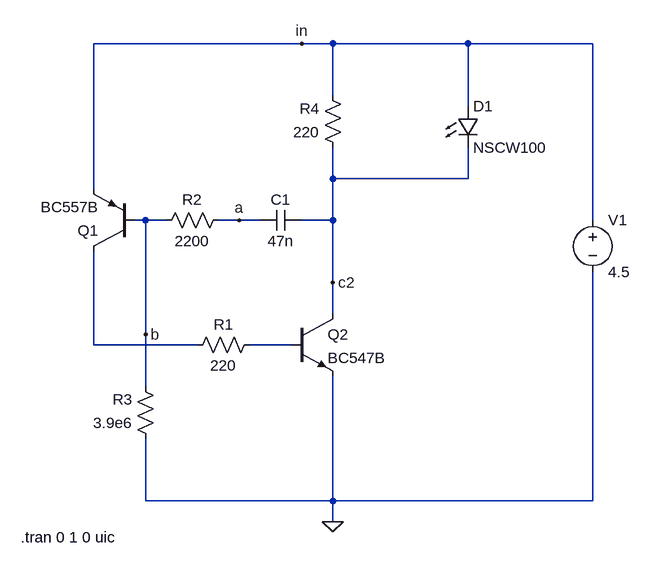
[diagram p0: schematic Draft1.asc]
Draft1.asc, the LTspice schematic file:
Version 4
SHEET 1 912 696
WIRE 400 -80 80 -80
WIRE 448 -80 400 -80
WIRE 656 -80 448 -80
WIRE 848 -80 656 -80
WIRE 448 0 448 -80
WIRE 656 16 656 -80
WIRE 448 128 448 80
WIRE 656 128 656 80
WIRE 656 128 448 128
WIRE 80 144 80 -80
WIRE 160 192 144 192
WIRE 192 192 160 192
WIRE 304 192 272 192
WIRE 336 192 304 192
WIRE 448 192 448 128
WIRE 448 192 400 192
WIRE 848 192 848 -80
WIRE 448 288 448 192
WIRE 448 336 448 288
WIRE 160 368 160 192
WIRE 80 384 80 240
WIRE 240 384 80 384
WIRE 384 384 320 384
WIRE 160 448 160 368
WIRE 160 624 160 528
WIRE 448 624 448 432
WIRE 448 624 160 624
WIRE 848 624 848 272
WIRE 848 624 448 624
WIRE 448 656 448 624
FLAG 448 656 0
FLAG 400 -80 in
FLAG 448 288 c2
FLAG 304 192 a
FLAG 160 368 b
SYMBOL pnp 144 240 R180
SYMATTR InstName Q1
SYMATTR Value BC557B
SYMBOL npn 384 336 R0
SYMATTR InstName Q2
SYMATTR Value BC547B
SYMBOL res 224 400 R270
WINDOW 0 32 56 VTop 2
WINDOW 3 0 56 VBottom 2
SYMATTR InstName R1
SYMATTR Value 220
SYMBOL res 176 208 R270
WINDOW 0 32 56 VTop 2
WINDOW 3 0 56 VBottom 2
SYMATTR InstName R2
SYMATTR Value 2200
SYMBOL res 176 544 R180
WINDOW 0 36 76 Left 2
WINDOW 3 36 40 Left 2
SYMATTR InstName R3
SYMATTR Value 3.9e6
SYMBOL res 464 96 R180
WINDOW 0 36 76 Left 2
WINDOW 3 36 40 Left 2
SYMATTR InstName R4
SYMATTR Value 220
SYMBOL cap 336 208 R270
WINDOW 0 32 32 VTop 2
WINDOW 3 0 32 VBottom 2
SYMATTR InstName C1
SYMATTR Value 47n
SYMBOL LED 640 16 R0
SYMATTR InstName D1
SYMATTR Value NSCW100
SYMBOL voltage 848 176 R0
WINDOW 123 0 0 Left 0
WINDOW 39 0 0 Left 0
SYMATTR InstName V1
SYMATTR Value 4.5
TEXT -32 680 Left 2 !.tran 0 1 0 uic

The netlist it stands for:
* Draft1.asc
Q1 N001 b in 0 BC557B
Q2 c2 N002 0 0 BC547B
R1 N001 N002 220
R2 b a 2200
R3 0 b 3.9e6
R4 c2 in 220
C1 a c2 47n
D1 in c2 NSCW100
V1 in 0 4.5
.model D D
.lib standard.dio
.model NPN NPN
.model PNP PNP
.lib standard.bjt
.tran 0 1 0 uic
.backanno
.end